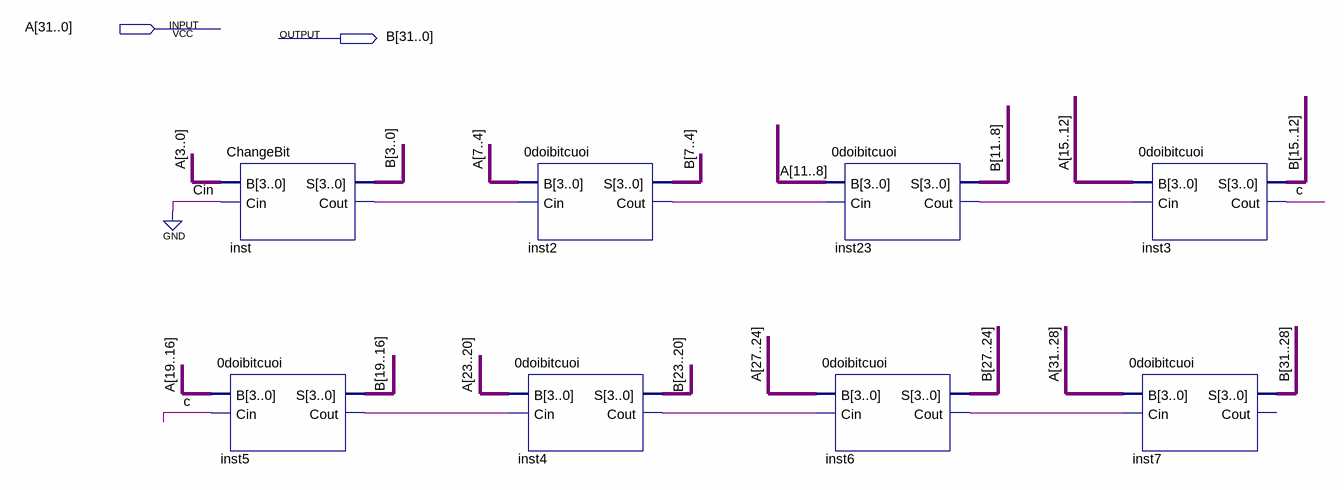
[diagram p0: schematic sheet]
// Quartus schematic TEST_8BIT.bdf as structural Verilog: 8 symbols, 2 pins
module TEST_8BIT (
  input  [31:0] A,
  output [31:0] B
);

  wire c, inst2_cout, inst4_cout, inst5_cout, inst6_cout, inst23_cout, inst_cout;

  ChangeBit inst (.B(A[3:0]), .Cin(1'b0), .S(B[3:0]), .Cout(inst_cout));
  \0doibitcuoi  inst5 (.B(A[19:16]), .Cin(c), .S(B[19:16]), .Cout(inst5_cout));
  \0doibitcuoi  inst2 (.B(A[7:4]), .Cin(inst_cout), .S(B[7:4]), .Cout(inst2_cout));
  \0doibitcuoi  inst4 (.B(A[23:20]), .Cin(inst5_cout), .S(B[23:20]), .Cout(inst4_cout));
  \0doibitcuoi  inst23 (.B(A[11:8]), .Cin(inst2_cout), .S(B[11:8]), .Cout(inst23_cout));
  \0doibitcuoi  inst6 (.B(A[27:24]), .Cin(inst4_cout), .S(B[27:24]), .Cout(inst6_cout));
  \0doibitcuoi  inst3 (.B(A[15:12]), .Cin(inst23_cout), .S(B[15:12]), .Cout(c));
  \0doibitcuoi  inst7 (.B(A[31:28]), .Cin(inst6_cout), .S(B[31:28]));  // open: Cout
endmodule
